# Altium schematic sheet AD9959.SchDoc
size A4
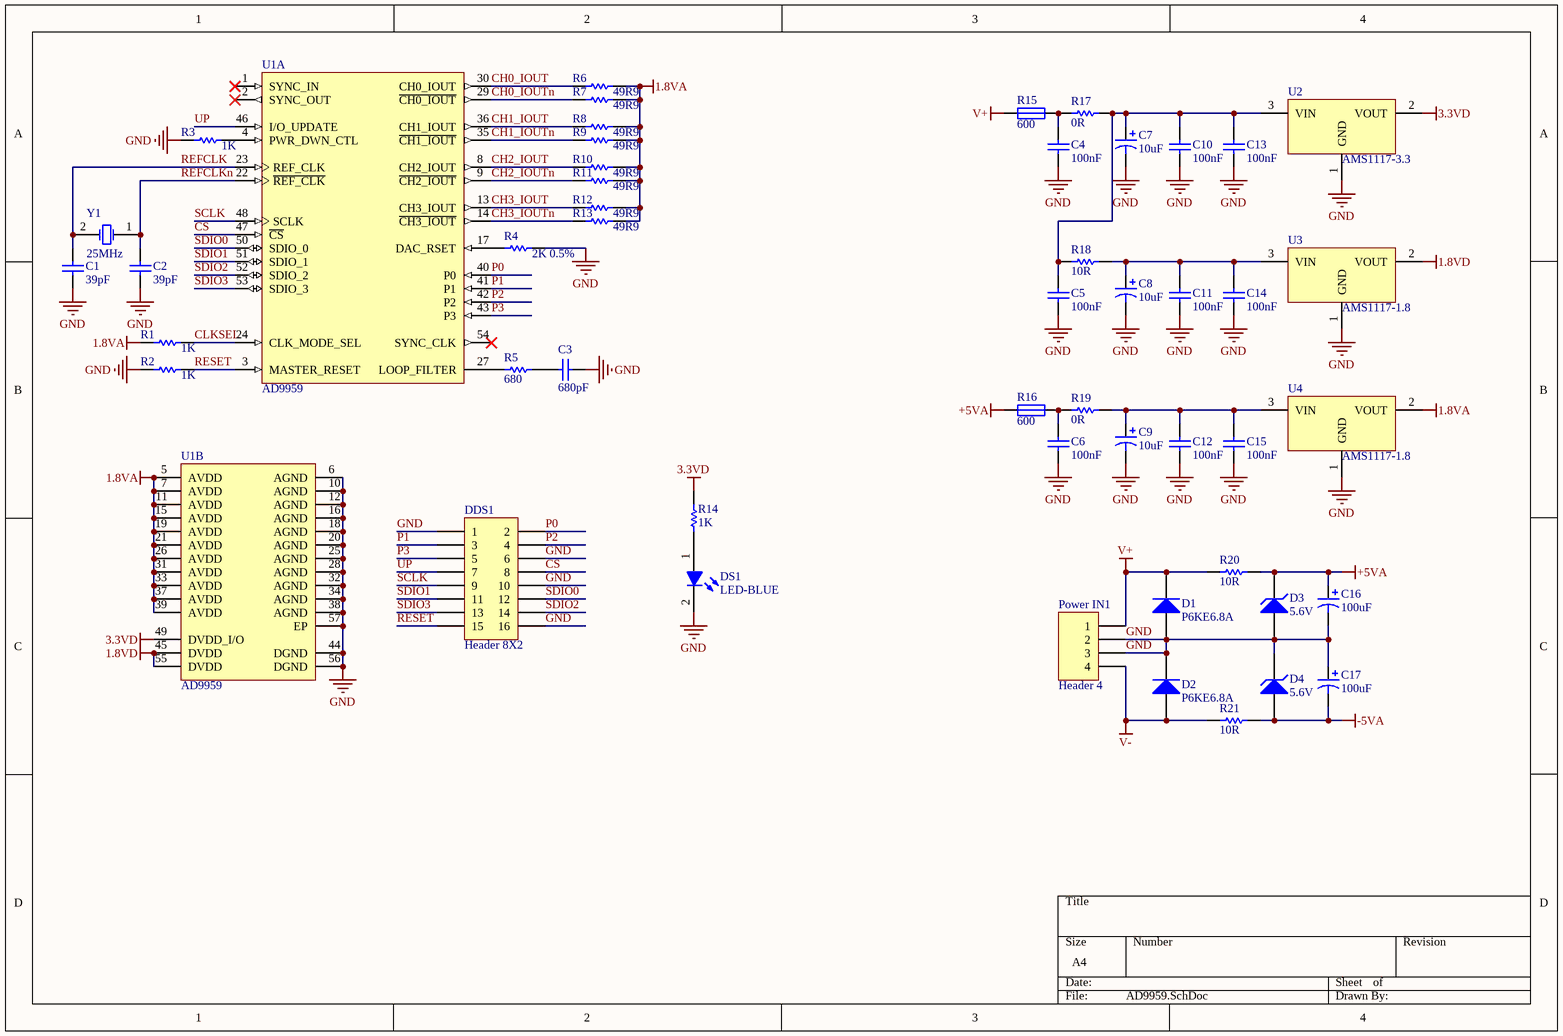
[diagram p0: AD9959.SchDoc]

## Parts
C1  39pF  [CAPC0603(1608)55_M]
C2  39pF  [CAPC0603(1608)55_M]
C3  680pF  [CAPC0603(1608)55_M]
C4  100nF  [CAPC0603(1608)55_M]
C5  100nF  [CAPC0603(1608)55_M]
C6  100nF  [CAPC0603(1608)55_M]
C7  10uF  [CAPC3528]
C8  10uF  [CAPC3528]
C9  10uF  [CAPC3528]
C10  100nF  [CAPC0603(1608)55_M]
C11  100nF  [CAPC0603(1608)55_M]
C12  100nF  [CAPC0603(1608)55_M]
C13  100nF  [CAPC0603(1608)55_M]
C14  100nF  [CAPC0603(1608)55_M]
C15  100nF  [CAPC0603(1608)55_M]
C16  100uF  [CAPC7343]
C17  100uF  [CAPC7343]
D1  P6KE6.8A  [DO-214AC]
D2  P6KE6.8A  [DO-214AC]
D3  5.6V  [LL34]
D4  5.6V  [LL34]
DDS1  Header 8X2  [HEADER8X2]
DS1  LED-BLUE  [0603LED_BLUE_V]
Power_IN1  Header 4  [3.96-4]
R1  1K  [RESC0603(1608)_M]
R2  1K  [RESC0603(1608)_M]
R3  1K  [RESC0603(1608)_M]
R4  2K 0.5%  [RESC0603(1608)_M]
R5  680  [RESC0603(1608)_M]
R6  49R9  [RESC0603(1608)_M]
R7  49R9  [RESC0603(1608)_M]
R8  49R9  [RESC0603(1608)_M]
R9  49R9  [RESC0603(1608)_M]
R10  49R9  [RESC0603(1608)_M]
R11  49R9  [RESC0603(1608)_M]
R12  49R9  [RESC0603(1608)_M]
R13  49R9  [RESC0603(1608)_M]
R14  1K  [RESC0603(1608)_M]
R15  600  [SMD1206]
R16  600  [SMD1206]
R17  0R  [RESC0603(1608)_M]
R18  10R  [RESC0603(1608)_M]
R19  0R  [RESC0603(1608)_M]
R20  10R  [RESC0603(1608)_M]
R21  10R  [RESC0603(1608)_M]
U1  AD9959  [QFN56]  (parts A,B of 2)
U2  AMS1117-3.3  [SOT-223_M]
U3  AMS1117-1.8  [SOT-223_M]
U4  AMS1117-1.8  [SOT-223_M]
Y1  25MHz  [HC-49S]

## Nets
1.8VA: R1.1 R6.2 R7.2 R8.2 R9.2 R10.2 R11.2 R12.2 R13.2 U1.5(AVDD) U1.7(AVDD) U1.11(AVDD) U1.15(AVDD) U1.19(AVDD) U1.21(AVDD) U1.26(AVDD) U1.31(AVDD) U1.33(AVDD) U1.37(AVDD) U1.39(AVDD) U4.2(VOUT)
1.8VD: U1.45(DVDD) U1.55(DVDD) U3.2(VOUT)
3.3VD: R14.2 U1.49(DVDD_I/O) U2.2(VOUT)
+5VA: C16.1 D3.2(K) R16.1 R20.2
-5VA: C17.2 D4.1(A) R21.2
GND: C1.1 C2.1 C3.2 C4.1 C5.1 C6.1 C7.2 C8.2 C9.2 C10.1 C11.1 C12.1 C13.1 C14.1 C15.1 C16.2 C17.1 D1.2(A) D2.1(K) D3.1(A) D4.2(K) DDS1.1 DDS1.6 DDS1.10 DDS1.16 DS1.2(K) Power_IN1.2 Power_IN1.3 R2.1 R3.1 R4.2 U1.6(AGND) U1.10(AGND) U1.12(AGND) U1.16(AGND) U1.18(AGND) U1.20(AGND) U1.25(AGND) U1.28(AGND) U1.32(AGND) U1.34(AGND) U1.38(AGND) U1.44(DGND) U1.56(DGND) U1.57(EP) U2.1(GND) U3.1(GND) U4.1(GND)
V+: D1.1(K) Power_IN1.1 R15.1 R20.1
V-: D2.2(A) Power_IN1.4 R21.1
CH0_IOUT: R6.1 U1.30(CH0_IOUT)
CH0_IOUTn: R7.1 U1.29(~{CH0_IOUT})
CH1_IOUT: R8.1 U1.36(CH1_IOUT)
CH1_IOUTn: R9.1 U1.35(~{CH1_IOUT})
CH2_IOUT: R10.1 U1.8(CH2_IOUT)
CH2_IOUTn: R11.1 U1.9(~{CH2_IOUT})
CH3_IOUT: R12.1 U1.13(CH3_IOUT)
CH3_IOUTn: R13.1 U1.14(~{CH3_IOUT})
CLKSEL: R1.2 U1.24(CLK_MODE_SEL)
CS: DDS1.8 U1.47(~{CS})
P0: DDS1.2 U1.40(P0)
P1: DDS1.3 U1.41(P1)
P2: DDS1.4 U1.42(P2)
P3: DDS1.5 U1.43(P3)
REFCLK: C1.2 U1.23(REF_CLK) Y1.2(OSC2)
REFCLKn: C2.2 U1.22(~{REF_CLK}) Y1.1(OSC1)
RESET: DDS1.15 R2.2 U1.3(MASTER_RESET)
SCLK: DDS1.9 U1.48(SCLK)
SDIO0: DDS1.12 U1.50(SDIO_0)
SDIO1: DDS1.11 U1.51(SDIO_1)
SDIO2: DDS1.14 U1.52(SDIO_2)
SDIO3: DDS1.13 U1.53(SDIO_3)
UP: DDS1.7 U1.46(I/O_UPDATE)
NetC3_1: C3.1 R5.2
NetC4_2: C4.2 R15.2 R17.1
NetC5_2: C5.2 C7.1 C10.2 C13.2 R17.2 R18.1 U2.3(VIN)
NetC6_2: C6.2 R16.2 R19.1
NetC8_1: C8.1 C11.2 C14.2 R18.2 U3.3(VIN)
NetC9_1: C9.1 C12.2 C15.2 R19.2 U4.3(VIN)
NetDS1_1: DS1.1(A) R14.1
NetR3_2: R3.2 U1.4(PWR_DWN_CTL)
NetR4_1: R4.1 U1.17(DAC_RSET)
NetR5_1: R5.1 U1.27(LOOP_FILTER)

Not connected (* = marked no-connect by the designer): U1 1(SYNC_IN)* 2(SYNC_OUT)* 54(SYNC_CLK)*

## Library data of the parts
C1-C6 C10-C15 = CAP
C7-C9 C16 C17 = CAP-Pol
D1 D2 = Diode: pin to pad: 1>2 2>1
D3 D4 = D Zener: Zener Diode; Published: 8-Jun-2000; LatestRevisionDate: 17-Jul-2002; LatestRevisionNote: Re-released for DXP Platform.; PackageReference: DIODE-0.7; Publisher: Altium Limited; PackageDescription: Diode, Thru-Hole; 2 Leads; 0.7 in Pin Spacing
DDS1 = Header 8X2: Header, 8-Pin, Dual row; LatestRevisionDate: 17-Jul-2002; LatestRevisionNote: Re-released for DXP Platform.; Publisher: Altium Limited
Power_IN1 = Header 4: Header, 4-Pin; LatestRevisionDate: 17-Jul-2002; LatestRevisionNote: Re-released for DXP Platform.; Publisher: Altium Limited
R1-R14 R17-R21 = RES
R15 R16 = Ferrite Bead: Manufacturer: Generic Components; Class: Passive; SubClass: Resistor; Value: 4K7; Published: 08/06/2000; Publisher: Altium Hobart Technology Centre
U2-U4 = AMS1117
Y1 = XTAL: Crystal Oscillator; Published: 8-Jun-2000; LatestRevisionDate: 17-Jul-2002; LatestRevisionNote: Re-released for DXP Platform.; PackageReference: R38; Publisher: Altium Limited; PackageDescription: Crystal, Thru-Hole; 2 Leads; Body 3.1 x 8.2 mm (Dia.xH)